# Altium schematic sheet Comm.SchDoc
size A3
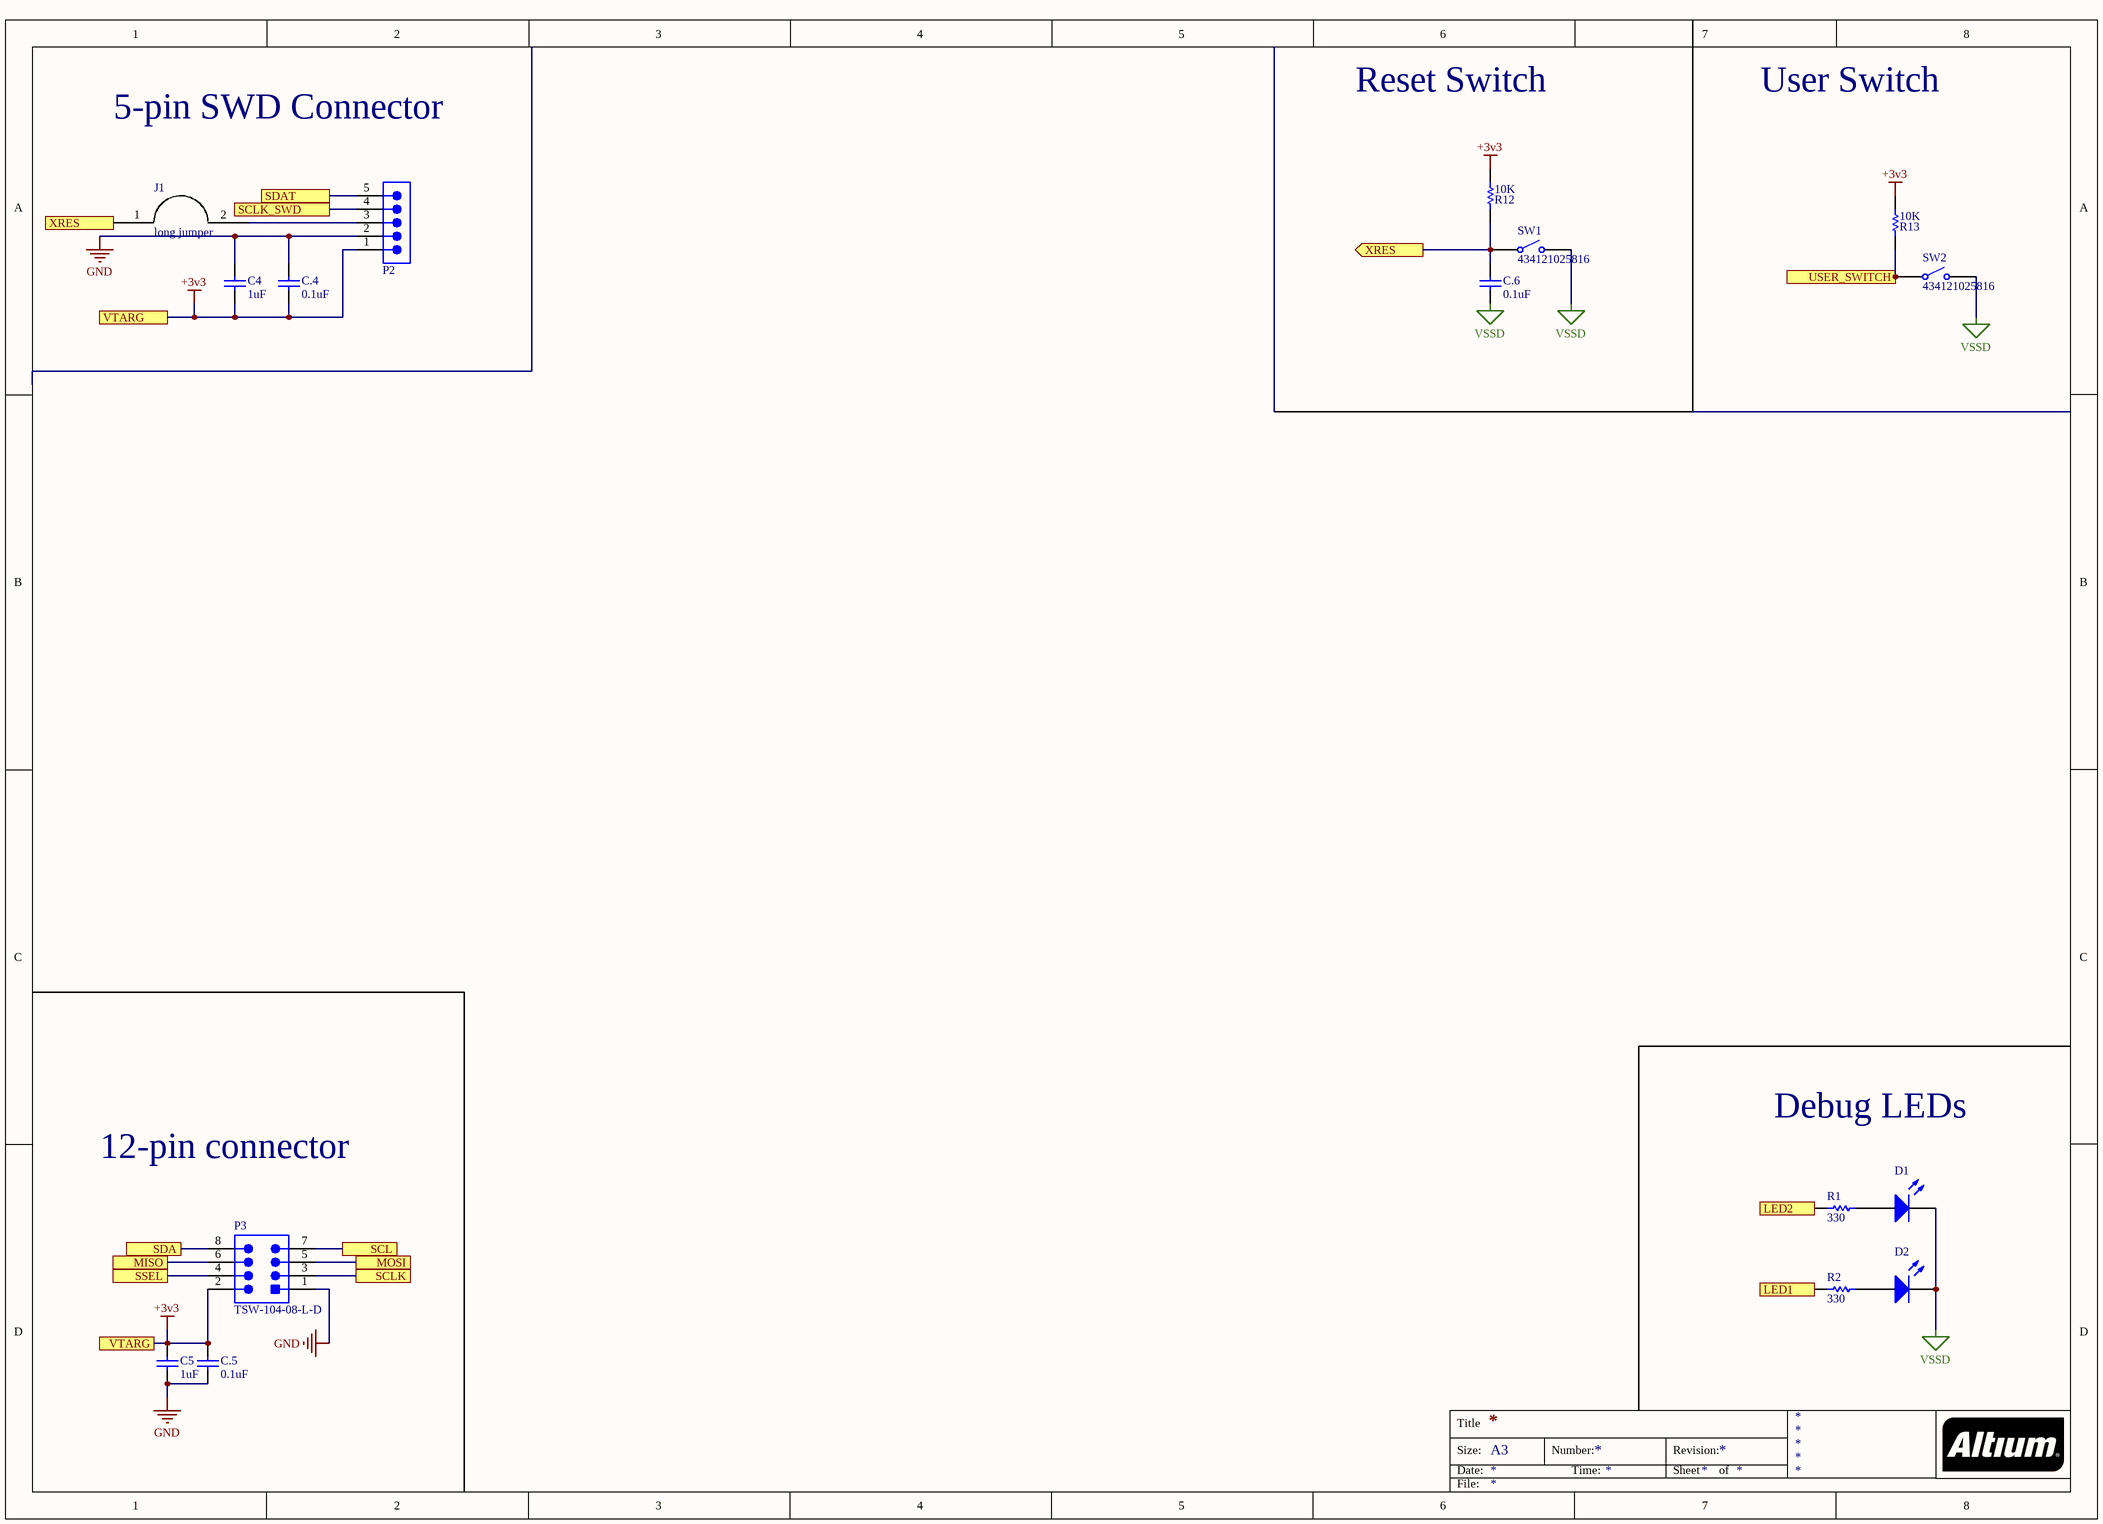
[diagram p0: Comm.SchDoc]

## Parts
C4  1uF  [CAPC0603(1608)100_N]
C5  1uF  [CAPC0603(1608)100_N]
C.4  0.1uF  [CAPC0603(1608)100_N]
C.5  0.1uF  [CAPC0603(1608)100_N]
C.6  0.1uF  [CAPC0603(1608)100_N]
D1  150060BS75000  [0603_A]  (value not drawn)
D2  150060BS75000  [0603_A]  (value not drawn)
J1  long jumper  [PCBComponent_1]
P2  MTLW-105-05-L-S-190  [SMTC-MTLW-105-05-X-S-190]  (value not drawn)
P3  TSW-104-08-L-D  [SMTC-TSW-104-08-L-D_V]
R1  330  [RESC0603(1608)_L]
R2  330  [RESC0603(1608)_L]
R12  10K  [RESC1608X55X25ML10T15]
R13  10K  [RESC1608X55X25ML10T15]
SW1  434121025816  [434121025816]
SW2  434121025816  [434121025816]

## Ports
LED1 (in), LED2 (in), MISO, MOSI, SCL, SCLK, SCLK_SWD, SDA, SDAT, SSEL, USER_SWITCH, VTARG, XRES, XRES (out)

## Nets
+3v3: C4.1 C5.2 C.4.1 C.5.2 P2.1 P3.2 R12.2 R13.2 ; port VTARG
GND: C4.2 C5.1 C.4.2 C.5.1 P2.2 P3.1
VSSD: C.6.1 D1.1(K) D2.1(K) SW1.2 SW2.2
LED1: R2.1 ; port LED1
LED2: R1.1 ; port LED2
MISO: P3.6 ; port MISO
MOSI: P3.5 ; port MOSI
SCL: P3.7 ; port SCL
SCLK: P3.3 ; port SCLK
SCLK_SWD: P2.4 ; port SCLK_SWD
SDA: P3.8 ; port SDA
SDAT: P2.5 ; port SDAT
SSEL: P3.4 ; port SSEL
USER_SWITCH: R13.1 SW2.1 ; port USER_SWITCH
XRES: C.6.2 J1.1 R12.1 SW1.1 ; port XRES
NetD1_2: D1.2(A) R1.2
NetD2_2: D2.2(A) R2.2
NetJ1_2: J1.2 P2.3

## Notes on the sheet
- 5-pin SWD Connector
- Reset Switch
- User Switch
- Debug LEDs
- 12-pin connector
- Title
- Size:
- Date:
- A3
- Number:
- Time:
- Revision:
- Sheet
- of
- File:

## Library data of the parts
C4 C5 = CMP-1035-02746-1: CAP 1uF 50V ±20% 0603 (1608 Metric) Thickness 1mm SMD; Tolerance: Â±20%; Case-EIA: 0603; Case-Metric: 1608; Value: 1uF; Technology: SMT; Max Thickness: 1 mm; Rated Voltage: 50 V
C.4-C.6 = CMP-1035-02746-1: CAP 0.1 uF 50V ±20% 0603 (1608 Metric) Thickness 1mm SMD; Tolerance: Â±20%; Value: 1uF; Case-EIA: 0603; Case-Metric: 1608; Technology: SMT; Max Thickness: 1 mm; Rated Voltage: 50 V
D1 D2 = CMP-1426-00003-1: SMD mono-color Chip LED, WL-SMCW, Blue; Manufacturer: Wuerth Elektronik; Color: Blue; ComponentLink2Description: Datasheet; ComponentLink2URL: http://katalog.we-online.com/led/datasheet/150060BS75000.pdf; ComponentLink1URL: http://www.we-online.com; PackageReference: 0603_A; PartNumber: 150060BS75000; ComponentLink1Description: Manufacturer URL
P2 = CMP-1024-00079-1: Low Profile .025" SQ Post Header, Through-hole, Vertical, -55 to 125 degC, 2.54 mm Pitch, 5-Pin, Male, RoHS; Manufacturer: Samtec; Pitch: 2.54 mm; Mounting Technology: Through-hole; ComponentLink2Description: Datasheet; DatasheetVersion: F-214; Temperature Range: -55 to 125 degC; ComponentLink1Description: Manufacturer URL; Orientation: Vertical; ComponentLink2URL: http://www.samtec.com/documents/webfiles/pdf/MTLW_TH.PDF; PackageDescription: Low Profile Terminal Assembly; PackageVersion: T, 6/1991; RoHS: True; ComponentLink3Description: Package Specification; ComponentLink1URL: http://www.samtec.com; PackageReference: MTLW-105-05-X-S-190; ComponentLink3URL: http://www.samtec.com/documents/webfiles/cpdf/MTLW-1XX-XX-XX-X-XXX-XX-XX-MKT1.pdf; PartNumber: MTLW-105-05-L-S-190
P3 = CMP-1681-00006-4: Male Header, Pitch 2.54 mm, 2 x 4 Position, Height 8.38 mm, Tail Length 5.08 mm, -55 to 125 degC, RoHS, Bulk; Manufacturer: Samtec; Voltage Rating: 550 V; Current Rating: 7.6 A; Rows: 2; ComponentLink2URL: https://datasheet.ciiva.com/25616/0900766b81154476-25616879.pdf; Package Quantity: 1; PackageDescription: Male Header, Pitch 2.54 mm, 2 x 4 Position, Height 8.38 mm, Tail Length 5.08 mm; ComponentLink1Description: Manufacturer URL; Lead Pitch: 0.1 inch; REACH SVHC: No SVHC; Mounting Technology: Through Hole; PackageReference: TSW-104-08-L-D; Contact Plating: Gold; DatasheetVersion: 04/2012; Colour: Black; Contact Finish: Gold; ComponentLink3URL: http://suddendocs.samtec.com/prints/tsw-xxx-xx-x-x-xx-xxx-footprint.pdf; ComponentLink3Description: Package Specification; Mount: Through Hole; RoHSCompliant: true; Packaging: Bulk; ComponentLink2Description: Datasheet; Contact Material: Bronze; Pins: 8; ComponentLink1URL: http://www.samtec.com/
R1 R2 = CMP-1012-00062-1: 330R 0.1W 5% 0603 (1608 Metric)  SMD; Value: 330.00 Ohm; Case-EIA: 0603; Case-Metric: 1608; Tolerance: 5 %; Power: 0.1 W; Technology: SMT
R12 R13 = CMP-2000-05024-1: Chip Resistor, 4.7 KOhm, +/- 5%, 100 mW, -55 to 155 degC, 0603 (1608 Metric), RoHS, Tape and Reel; Manufacturer: Yageo; Resistance: 4.7kOhms; Temperature Coefficient: 100PPM/C; Power Rating: 100mW; Voltage Rating: 50V; Operating Temperature Range: -55Cto+155C; Case Code - mm: 1608; Tolerance: 5%; Product: ThickFilmResistorsGeneralPurpose; Case Code - in: 0603; Datasheet URL: http://www.yageo.com/documents/recent/PYu-RC_Group_51_RoHS_L_04.pdf; Package Reference: 603; Datasheet Version: Rev. 4, 02/2016; Package Description: 2-Pin Surface Mount Device, Body 1.6 x 0.8 mm; Manufacturer URL: http://www.yageo.com/; Series: RC; Packaging: Reel; Termination Style: SMD/SMT
SW1 SW2 = CMP-1459-00004-1: WS-TASV SMD Tact Switch 6.0X3.8 mm; Manufacturer: Wuerth Elektronik; NoPins: 02; PackageReference: 434121025816; ComponentLink2URL: http://katalog.we-online.de/em/datasheet/434121025816.pdf; PartNumber: 434121025816; ComponentLink2Description: Datasheet; ComponentLink1URL: http://www.we-online.com; ComponentLink1Description: Manufacturer URL